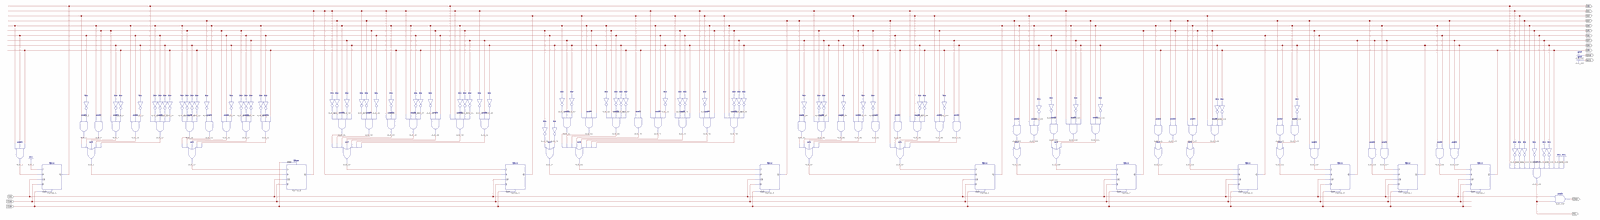
[diagram p0: schematic sheet 1, whole]
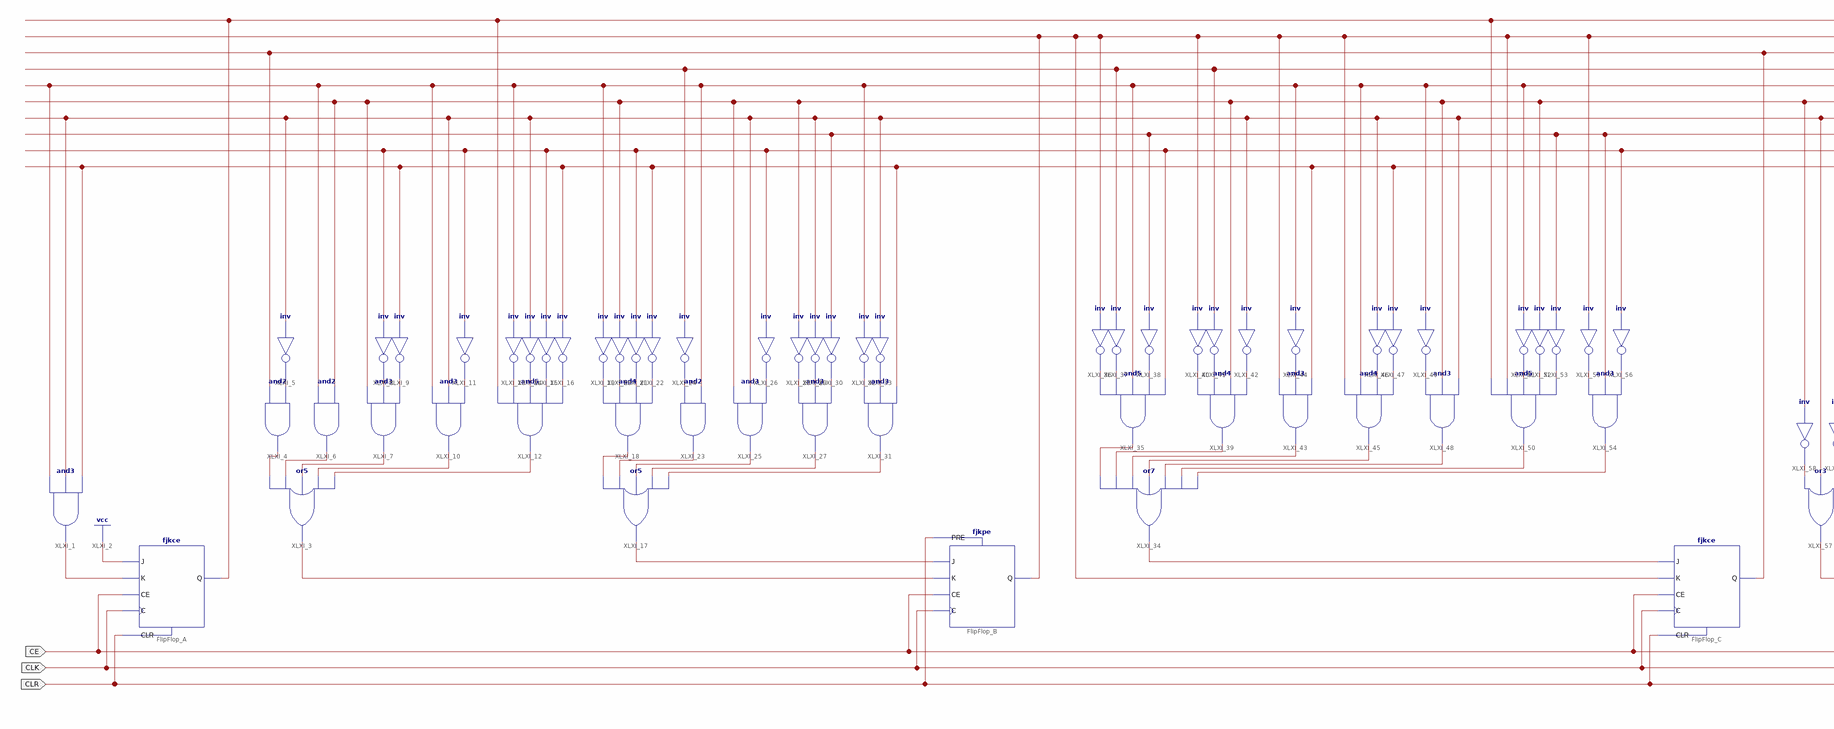
[diagram p1: schematic sheet 1, left part]
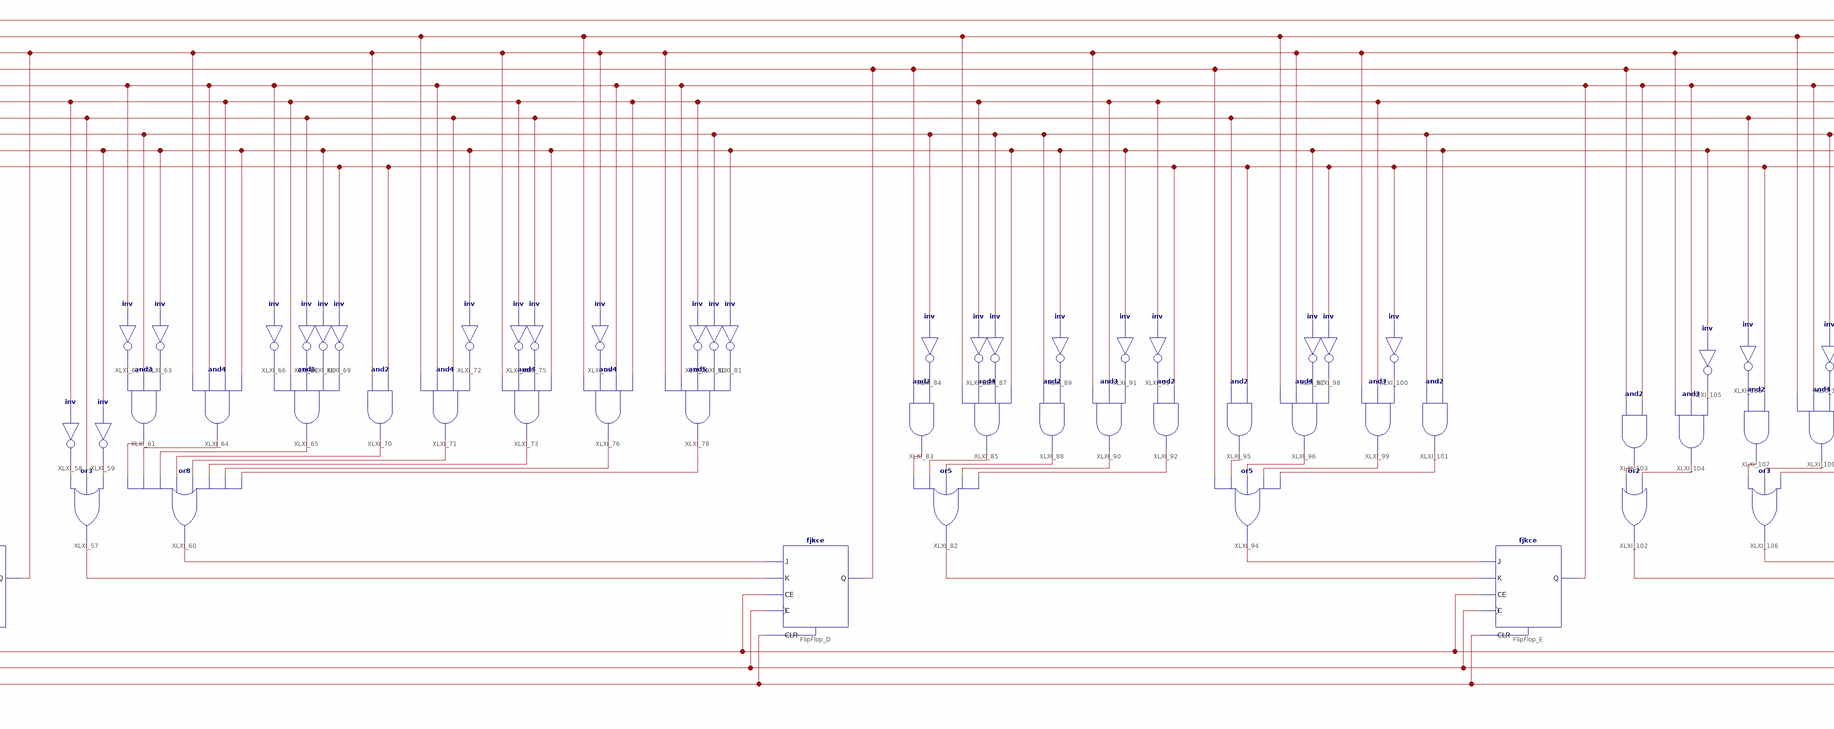
[diagram p2: schematic sheet 1, centre part]
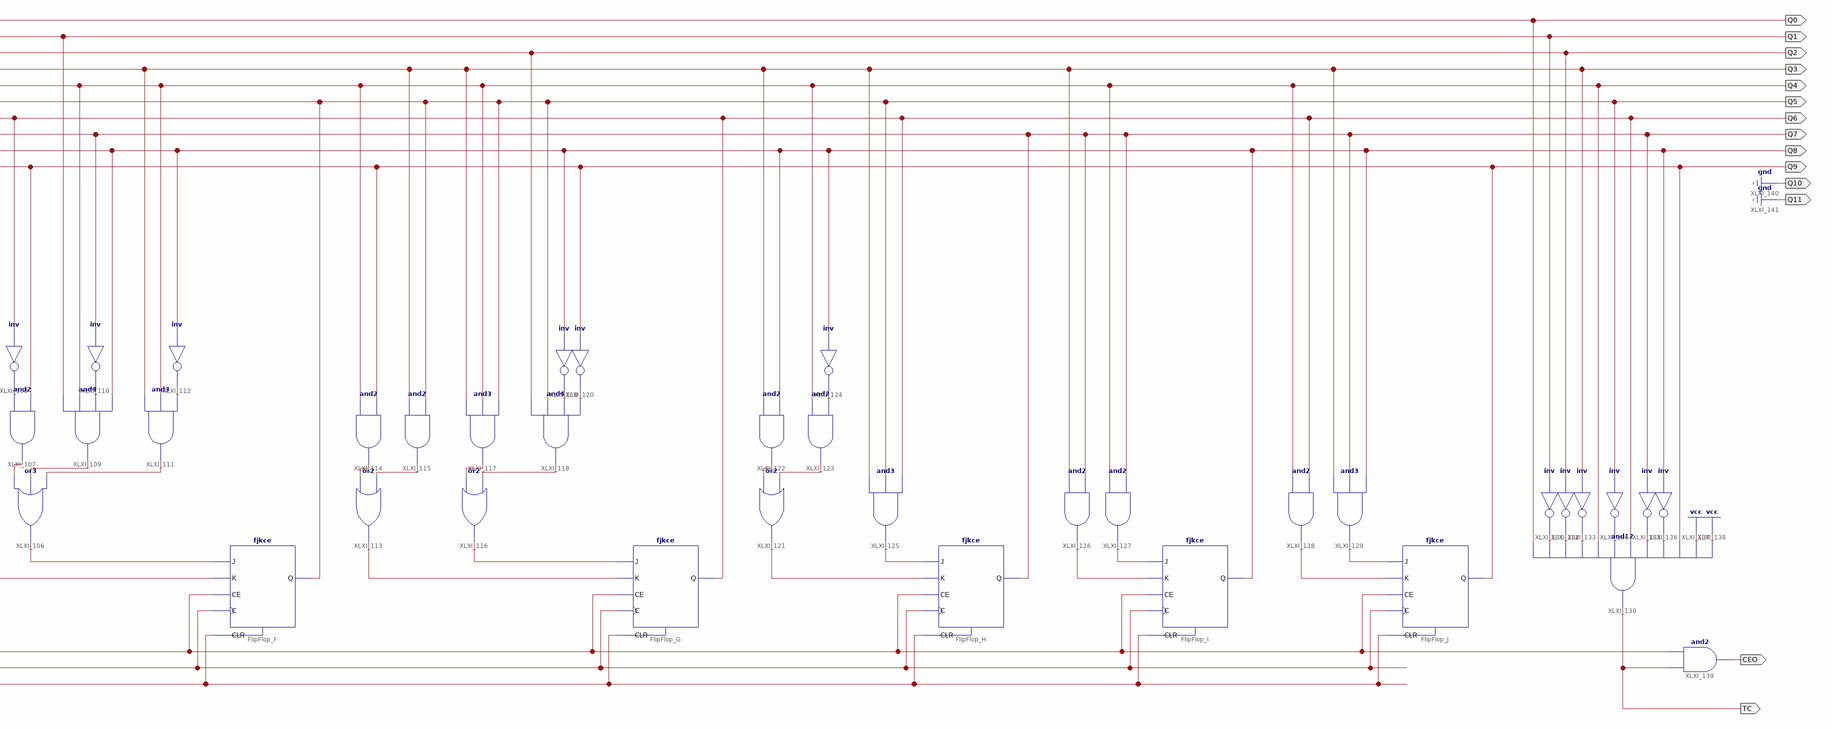
[diagram p3: schematic sheet 1, right part]
// Xilinx ISE schematic counterprime.sch (spartan6) as structural Verilog: 146 symbols, 17 ports
module counterprime (
  input  CE,
  input  CLK,
  input  CLR,
  output CEO,
  output TC,
  output Q0,
  output Q1,
  output Q2,
  output Q3,
  output Q4,
  output Q5,
  output Q6,
  output Q7,
  output Q8,
  output Q9,
  output Q10,
  output Q11
);

  wire XLXN_1, XLXN_3, XLXN_4, XLXN_5, XLXN_6, XLXN_7, XLXN_8, XLXN_9, XLXN_10, XLXN_11, XLXN_12, XLXN_13,
       XLXN_14, XLXN_15, XLXN_16, XLXN_17, XLXN_18, XLXN_19, XLXN_20, XLXN_21, XLXN_22, XLXN_23, XLXN_24,
       XLXN_25, XLXN_26, XLXN_27, XLXN_28, XLXN_29, XLXN_30, XLXN_31, XLXN_32, XLXN_33, XLXN_34, XLXN_35,
       XLXN_36, XLXN_37, XLXN_38, XLXN_39, XLXN_40, XLXN_41, XLXN_42, XLXN_43, XLXN_44, XLXN_45, XLXN_46,
       XLXN_47, XLXN_48, XLXN_49, XLXN_50, XLXN_51, XLXN_52, XLXN_53, XLXN_54, XLXN_55, XLXN_56, XLXN_57,
       XLXN_58, XLXN_59, XLXN_60, XLXN_61, XLXN_62, XLXN_63, XLXN_64, XLXN_65, XLXN_66, XLXN_67, XLXN_68,
       XLXN_69, XLXN_70, XLXN_71, XLXN_72, XLXN_73, XLXN_74, XLXN_75, XLXN_76, XLXN_77, XLXN_78, XLXN_79,
       XLXN_80, XLXN_81, XLXN_82, XLXN_83, XLXN_84, XLXN_85, XLXN_86, XLXN_87, XLXN_88, XLXN_89, XLXN_90,
       XLXN_91, XLXN_92, XLXN_93, XLXN_94, XLXN_95, XLXN_96, XLXN_97, XLXN_98, XLXN_99, XLXN_100, XLXN_101,
       XLXN_102, XLXN_103, XLXN_104, XLXN_105, XLXN_106, XLXN_107, XLXN_108, XLXN_109, XLXN_110, XLXN_111,
       XLXN_112, XLXN_113, XLXN_114, XLXN_115, XLXN_116, XLXN_117, XLXN_118, XLXN_119, XLXN_120, XLXN_121,
       XLXN_122, XLXN_123, XLXN_124, XLXN_125, XLXN_126, XLXN_127, XLXN_128, XLXN_129, XLXN_130, XLXN_131,
       XLXN_132, XLXN_133, XLXN_134, XLXN_135;

  and XLXI_1 (XLXN_1, Q4, Q6, Q9);
  fjkce FlipFlop_A (.C(CLK), .CE(CE), .CLR(CLR), .J(1'b1), .K(XLXN_1), .Q(Q0));
  or XLXI_3 (XLXN_3, XLXN_4, XLXN_6, XLXN_7, XLXN_10, XLXN_12);
  and XLXI_4 (XLXN_4, Q2, XLXN_5);
  not XLXI_5 (XLXN_5, Q6);
  and XLXI_6 (XLXN_6, Q4, Q5);
  and XLXI_7 (XLXN_7, Q5, XLXN_8, XLXN_9);
  not XLXI_8 (XLXN_8, Q8);
  not XLXI_9 (XLXN_9, Q9);
  and XLXI_10 (XLXN_10, Q4, Q6, XLXN_11);
  not XLXI_11 (XLXN_11, Q8);
  and XLXI_12 (XLXN_12, Q0, XLXN_13, XLXN_14, XLXN_15, XLXN_16);
  not XLXI_13 (XLXN_13, Q4);
  not XLXI_14 (XLXN_14, Q6);
  not XLXI_15 (XLXN_15, Q8);
  not XLXI_16 (XLXN_16, Q9);
  or XLXI_17 (XLXN_17, XLXN_18, XLXN_23, XLXN_25, XLXN_27, XLXN_31);
  and XLXI_18 (XLXN_18, XLXN_19, XLXN_20, XLXN_21, XLXN_22);
  not XLXI_19 (XLXN_19, Q4);
  not XLXI_20 (XLXN_20, Q5);
  not XLXI_21 (XLXN_21, Q8);
  not XLXI_22 (XLXN_22, Q9);
  and XLXI_23 (XLXN_23, XLXN_24, Q4);
  not XLXI_24 (XLXN_24, Q3);
  and XLXI_25 (XLXN_25, Q5, Q6, XLXN_26);
  not XLXI_26 (XLXN_26, Q8);
  and XLXI_27 (XLXN_27, XLXN_28, XLXN_29, XLXN_30);
  not XLXI_28 (XLXN_28, Q5);
  not XLXI_29 (XLXN_29, Q6);
  not XLXI_30 (XLXN_30, Q7);
  and XLXI_31 (XLXN_31, XLXN_32, XLXN_33, Q9);
  not XLXI_32 (XLXN_32, Q4);
  not XLXI_33 (XLXN_33, Q6);
  fjkpe FlipFlop_B (.C(CLK), .CE(CE), .J(XLXN_17), .K(XLXN_3), .PRE(CLR), .Q(Q1));
  or XLXI_34 (XLXN_34, XLXN_35, XLXN_39, XLXN_43, XLXN_45, XLXN_48, XLXN_50, XLXN_54);
  and XLXI_35 (XLXN_35, XLXN_36, XLXN_37, Q4, XLXN_38, Q8);
  not XLXI_36 (XLXN_36, Q1);
  not XLXI_37 (XLXN_37, Q3);
  not XLXI_38 (XLXN_38, Q7);
  and XLXI_39 (XLXN_39, XLXN_40, XLXN_41, Q5, XLXN_42);
  not XLXI_40 (XLXN_40, Q1);
  not XLXI_41 (XLXN_41, Q3);
  not XLXI_42 (XLXN_42, Q6);
  and XLXI_43 (XLXN_43, Q1, XLXN_44, Q9);
  not XLXI_44 (XLXN_44, Q4);
  and XLXI_45 (XLXN_45, Q1, Q4, XLXN_46, XLXN_47);
  not XLXI_46 (XLXN_46, Q6);
  not XLXI_47 (XLXN_47, Q9);
  and XLXI_48 (XLXN_48, XLXN_49, Q5, Q6);
  not XLXI_49 (XLXN_49, Q4);
  and XLXI_50 (XLXN_50, Q0, Q1, XLXN_51, XLXN_52, XLXN_53);
  not XLXI_51 (XLXN_51, Q4);
  not XLXI_52 (XLXN_52, Q5);
  not XLXI_53 (XLXN_53, Q7);
  and XLXI_54 (XLXN_54, XLXN_55, Q7, XLXN_56);
  not XLXI_55 (XLXN_55, Q1);
  not XLXI_56 (XLXN_56, Q8);
  fjkce FlipFlop_C (.C(CLK), .CE(CE), .CLR(CLR), .J(XLXN_34), .K(Q1), .Q(Q2));
  or XLXI_57 (XLXN_57, XLXN_58, Q6, XLXN_59);
  not XLXI_58 (XLXN_58, Q5);
  not XLXI_59 (XLXN_59, Q8);
  or XLXI_60 (XLXN_60, XLXN_61, XLXN_64, XLXN_65, XLXN_70, XLXN_71, XLXN_73, XLXN_76, XLXN_78);
  and XLXI_61 (XLXN_61, XLXN_62, Q7, XLXN_63);
  not XLXI_62 (XLXN_62, Q4);
  not XLXI_63 (XLXN_63, Q8);
  and XLXI_64 (XLXN_64, Q2, Q4, Q5, Q8);
  and XLXI_65 (XLXN_65, XLXN_66, Q5, XLXN_67, XLXN_68, XLXN_69);
  not XLXI_66 (XLXN_66, Q4);
  not XLXI_67 (XLXN_67, Q6);
  not XLXI_68 (XLXN_68, Q8);
  not XLXI_69 (XLXN_69, Q9);
  and XLXI_70 (XLXN_70, Q2, Q9);
  and XLXI_71 (XLXN_71, Q1, Q4, Q6, XLXN_72);
  not XLXI_72 (XLXN_72, Q8);
  and XLXI_73 (XLXN_73, Q2, XLXN_74, XLXN_75, Q8);
  not XLXI_74 (XLXN_74, Q5);
  not XLXI_75 (XLXN_75, Q6);
  and XLXI_76 (XLXN_76, Q1, XLXN_77, Q4, Q5);
  not XLXI_77 (XLXN_77, Q2);
  and XLXI_78 (XLXN_78, Q2, Q4, XLXN_79, XLXN_80, XLXN_81);
  not XLXI_79 (XLXN_79, Q5);
  not XLXI_80 (XLXN_80, Q7);
  not XLXI_81 (XLXN_81, Q8);
  fjkce FlipFlop_D (.C(CLK), .CE(CE), .CLR(CLR), .J(XLXN_60), .K(XLXN_57), .Q(Q3));
  or XLXI_82 (XLXN_82, XLXN_83, XLXN_85, XLXN_88, XLXN_90, XLXN_92);
  and XLXI_83 (XLXN_83, Q3, XLXN_84);
  not XLXI_84 (XLXN_84, Q7);
  and XLXI_85 (XLXN_85, Q1, XLXN_86, XLXN_87, Q8);
  not XLXI_86 (XLXN_86, Q5);
  not XLXI_87 (XLXN_87, Q7);
  and XLXI_88 (XLXN_88, Q7, XLXN_89);
  not XLXI_89 (XLXN_89, Q8);
  and XLXI_90 (XLXN_90, Q2, Q5, XLXN_91);
  not XLXI_91 (XLXN_91, Q8);
  and XLXI_92 (XLXN_92, XLXN_93, Q9);
  not XLXI_93 (XLXN_93, Q5);
  or XLXI_94 (XLXN_94, Q3, XLXN_95, XLXN_96, XLXN_99, XLXN_101);
  and XLXI_95 (XLXN_95, Q6, Q9);
  and XLXI_96 (XLXN_96, Q1, Q2, XLXN_97, XLXN_98);
  not XLXI_97 (XLXN_97, Q8);
  not XLXI_98 (XLXN_98, Q9);
  and XLXI_99 (XLXN_99, Q2, Q5, XLXN_100);
  not XLXI_100 (XLXN_100, Q9);
  and XLXI_101 (XLXN_101, Q7, Q8);
  fjkce FlipFlop_E (.C(CLK), .CE(CE), .CLR(CLR), .J(XLXN_94), .K(XLXN_82), .Q(Q4));
  or XLXI_102 (XLXN_102, XLXN_103, XLXN_104);
  and XLXI_103 (XLXN_103, Q3, Q4);
  and XLXI_104 (XLXN_104, Q2, Q4, XLXN_105);
  not XLXI_105 (XLXN_105, Q8);
  or XLXI_106 (XLXN_106, XLXN_107, XLXN_109, XLXN_111);
  and XLXI_107 (XLXN_107, XLXN_108, Q9);
  not XLXI_108 (XLXN_108, Q6);
  and XLXI_109 (XLXN_109, Q1, Q4, XLXN_110, Q8);
  not XLXI_110 (XLXN_110, Q7);
  and XLXI_111 (XLXN_111, Q3, Q4, XLXN_112);
  not XLXI_112 (XLXN_112, Q8);
  fjkce FlipFlop_F (.C(CLK), .CE(CE), .CLR(CLR), .J(XLXN_106), .K(XLXN_102), .Q(Q5));
  or XLXI_113 (XLXN_113, XLXN_114, XLXN_115);
  and XLXI_114 (XLXN_114, Q4, Q9);
  and XLXI_115 (XLXN_115, Q3, Q5);
  or XLXI_116 (XLXN_116, XLXN_117, XLXN_118);
  and XLXI_117 (XLXN_117, Q3, Q4, Q5);
  and XLXI_118 (XLXN_118, Q2, Q5, XLXN_119, XLXN_120);
  not XLXI_119 (XLXN_119, Q8);
  not XLXI_120 (XLXN_120, Q9);
  fjkce FlipFlop_G (.C(CLK), .CE(CE), .CLR(CLR), .J(XLXN_116), .K(XLXN_113), .Q(Q6));
  or XLXI_121 (XLXN_121, XLXN_122, XLXN_123);
  and XLXI_122 (XLXN_122, Q3, Q8);
  and XLXI_123 (XLXN_123, Q4, XLXN_124);
  not XLXI_124 (XLXN_124, Q8);
  and XLXI_125 (XLXN_125, Q3, Q5, Q6);
  fjkce FlipFlop_H (.C(CLK), .CE(CE), .CLR(CLR), .J(XLXN_125), .K(XLXN_121), .Q(Q7));
  and XLXI_126 (XLXN_126, Q3, Q7);
  and XLXI_127 (XLXN_127, Q4, Q7);
  fjkce FlipFlop_I (.C(CLK), .CE(CE), .CLR(CLR), .J(XLXN_127), .K(XLXN_126), .Q(Q8));
  and XLXI_128 (XLXN_128, Q4, Q6);
  and XLXI_129 (XLXN_129, Q3, Q7, Q8);
  fjkce FlipFlop_J (.C(CLK), .CE(CE), .CLR(CLR), .J(XLXN_129), .K(XLXN_128), .Q(Q9));
  and XLXI_130 (TC, Q0, XLXN_130, XLXN_131, XLXN_132, Q4, XLXN_133, Q6, XLXN_134, XLXN_135, Q9, 1'b1, 1'b1);
  not XLXI_131 (XLXN_130, Q1);
  not XLXI_132 (XLXN_131, Q2);
  not XLXI_133 (XLXN_132, Q3);
  not XLXI_134 (XLXN_133, Q5);
  not XLXI_135 (XLXN_134, Q7);
  not XLXI_136 (XLXN_135, Q8);
  and XLXI_139 (CEO, CE, TC);

  assign Q10 = 1'b0;
  assign Q11 = 1'b0;
endmodule
